# EAGLE schematic alu4 (EAGLE 9.5.1)
ALU

## Sheet 1 of 9: Accum Reg
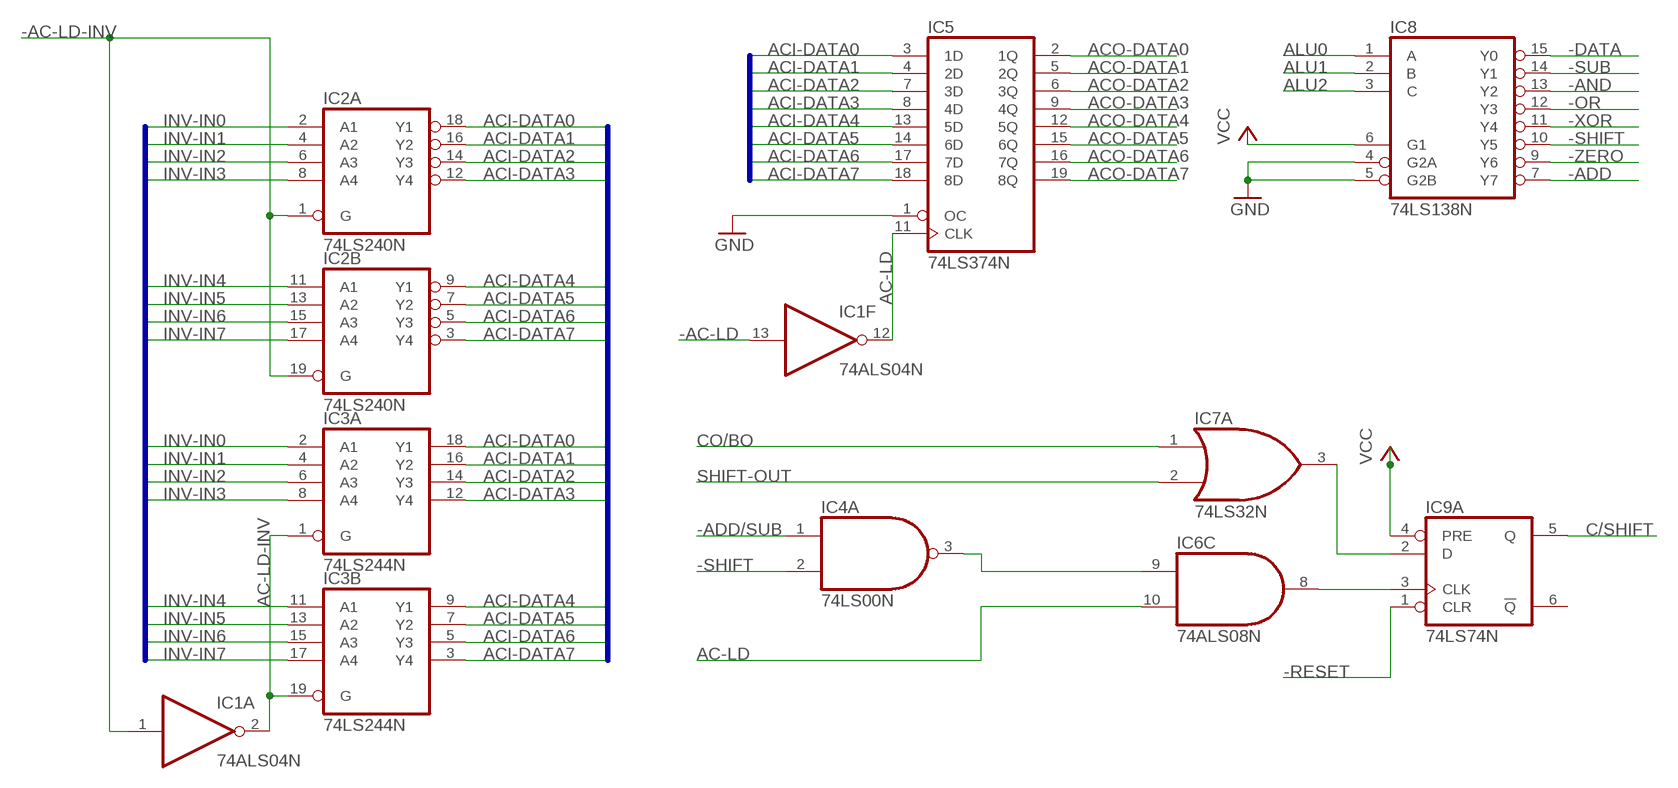
[diagram p0: schematic, sheet 1]

### Parts
IC1  74ALS04N  [DIL14]
IC2  74LS240N  [DIL20]
IC3  74LS244N  [DIL20]
IC4  74LS00N  [DIL14]
IC5  74LS374N  [DIL20]
IC6  74ALS08N  [DIL14]
IC7  74LS32N  [DIL14]
IC8  74LS138N  [DIL16]
IC9  74LS74N  [DIL14]

### Nets
-AC-LD: IC1.13(F:I) ; also sheet 3,9
-AC-LD-INV: IC1.1(A:I) IC2.1(A:G) IC2.19(B:G) ; also sheet 9
-ADD: IC8.7(Y7) ; also sheet 7
-ADD/SUB: IC4.1(A:I0) ; also sheet 7
-AND: IC8.13(Y2) ; also sheet 4
-DATA: IC8.15(Y0) ; also sheet 3
-OR: IC8.12(Y3) ; also sheet 4
-RESET: IC9.1(A:CLR) ; also sheet 6,9
-SHIFT: IC4.2(A:I1) IC8.10(Y5) ; also sheet 6
-SUB: IC8.14(Y1) ; also sheet 7
-XOR: IC8.11(Y4) ; also sheet 4
-ZERO: IC8.9(Y6) ; also sheet 4
AC-LD: IC1.12(F:O) IC5.11(CLK) IC6.10(C:I1)
AC-LD-INV: IC1.2(A:O) IC3.1(A:G) IC3.19(B:G) ; also sheet 5
ACI-DATA0: IC2.18(A:Y1) IC3.18(A:Y1) IC5.3(1D)
ACI-DATA1: IC2.16(A:Y2) IC3.16(A:Y2) IC5.4(2D)
ACI-DATA2: IC2.14(A:Y3) IC3.14(A:Y3) IC5.7(3D)
ACI-DATA3: IC2.12(A:Y4) IC3.12(A:Y4) IC5.8(4D)
ACI-DATA4: IC2.9(B:Y1) IC3.9(B:Y1) IC5.13(5D)
ACI-DATA5: IC2.7(B:Y2) IC3.7(B:Y2) IC5.14(6D)
ACI-DATA6: IC2.5(B:Y3) IC3.5(B:Y3) IC5.17(7D)
ACI-DATA7: IC2.3(B:Y4) IC3.3(B:Y4) IC5.18(8D)
ACO-DATA0: IC5.2(1Q) ; also sheet 3,4,5,6,7,9
ACO-DATA1: IC5.5(2Q) ; also sheet 3,4,5,6,7,9
ACO-DATA2: IC5.6(3Q) ; also sheet 3,4,5,6,7,9
ACO-DATA3: IC5.9(4Q) ; also sheet 3,4,5,6,7,9
ACO-DATA4: IC5.12(5Q) ; also sheet 3,4,5,6,7,9
ACO-DATA5: IC5.15(6Q) ; also sheet 3,4,5,6,7,9
ACO-DATA6: IC5.16(7Q) ; also sheet 3,4,5,6,7,9
ACO-DATA7: IC5.19(8Q) ; also sheet 3,4,5,6,7,9
ALU0: IC8.1(A) ; also sheet 5,6,9
ALU1: IC8.2(B) ; also sheet 5,6,9
ALU2: IC8.3(C) ; also sheet 5,6,9
C/SHIFT: IC9.5(A:Q) ; also sheet 5,6,7,9
CO/BO: IC7.1(A:I0) ; also sheet 7
GND: IC5.1(OC) IC8.4(G2A) IC8.5(G2B) ; also sheet 2,4,5,6,8,9
INV-IN0: IC2.2(A:A1) IC3.2(A:A1) ; also sheet 3,4,6,7
INV-IN1: IC2.4(A:A2) IC3.4(A:A2) ; also sheet 3,4,6,7
INV-IN2: IC2.6(A:A3) IC3.6(A:A3) ; also sheet 3,4,6,7
INV-IN3: IC2.8(A:A4) IC3.8(A:A4) ; also sheet 3,4,6,7
INV-IN4: IC2.11(B:A1) IC3.11(B:A1) ; also sheet 3,4,6,7
INV-IN5: IC2.13(B:A2) IC3.13(B:A2) ; also sheet 3,4,6,7
INV-IN6: IC2.15(B:A3) IC3.15(B:A3) ; also sheet 3,4,6,7
INV-IN7: IC2.17(B:A4) IC3.17(B:A4) ; also sheet 3,4,6,7
N$3: IC4.3(A:O) IC6.9(C:I0)
N$5: IC6.8(C:O) IC9.3(A:CLK)
N$7: IC7.3(A:O) IC9.2(A:D)
SHIFT-OUT: IC7.2(A:I1) ; also sheet 6
VCC: IC8.6(G1) IC9.4(A:PRE) ; also sheet 2,5,6,9
Unconnected: IC9.6(A:!Q)

### Buses
INV-IN[0..7]
ACI-DATA[0..7]

## Sheet 2 of 9: caps & pullups
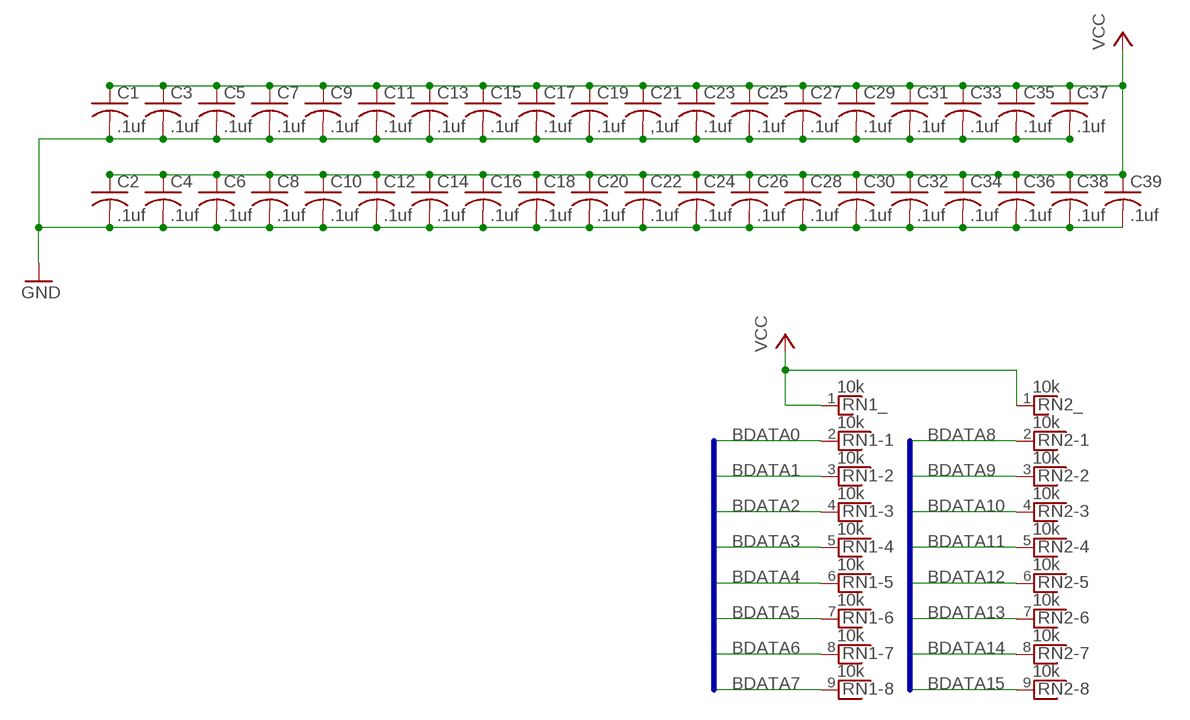
[diagram p1: schematic, sheet 2]

### Parts
C1  .1uf  C-US025-024X044  [C025-024X044]
C2  .1uf  C-US025-024X044  [C025-024X044]
C3  .1uf  C-US025-024X044  [C025-024X044]
C4  .1uf  C-US025-024X044  [C025-024X044]
C5  .1uf  C-US025-024X044  [C025-024X044]
C6  .1uf  C-US025-024X044  [C025-024X044]
C7  .1uf  C-US025-024X044  [C025-024X044]
C8  .1uf  C-US025-024X044  [C025-024X044]
C9  .1uf  C-US025-024X044  [C025-024X044]
C10  .1uf  C-US025-024X044  [C025-024X044]
C11  .1uf  C-US025-024X044  [C025-024X044]
C12  .1uf  C-US025-024X044  [C025-024X044]
C13  .1uf  C-US025-024X044  [C025-024X044]
C14  .1uf  C-US025-024X044  [C025-024X044]
C15  .1uf  C-US025-024X044  [C025-024X044]
C16  .1uf  C-US025-024X044  [C025-024X044]
C17  .1uf  C-US025-024X044  [C025-024X044]
C18  .1uf  C-US025-024X044  [C025-024X044]
C19  .1uf  C-US025-024X044  [C025-024X044]
C20  .1uf  C-US025-024X044  [C025-024X044]
C21  ,1uf  C-US025-024X044  [C025-024X044]
C22  .1uf  C-US025-024X044  [C025-024X044]
C23  .1uf  C-US025-024X044  [C025-024X044]
C24  .1uf  C-US025-024X044  [C025-024X044]
C25  .1uf  C-US025-024X044  [C025-024X044]
C26  .1uf  C-US025-024X044  [C025-024X044]
C27  .1uf  C-US025-024X044  [C025-024X044]
C28  .1uf  C-US025-024X044  [C025-024X044]
C29  .1uf  C-US025-024X044  [C025-024X044]
C30  .1uf  C-US025-024X044  [C025-024X044]
C31  .1uf  C-US025-024X044  [C025-024X044]
C32  .1uf  C-US025-024X044  [C025-024X044]
C33  .1uf  C-US025-024X044  [C025-024X044]
C34  .1uf  C-US025-024X044  [C025-024X044]
C35  .1uf  C-US025-024X044  [C025-024X044]
C36  .1uf  C-US025-024X044  [C025-024X044]
C37  .1uf  C-US025-024X044  [C025-024X044]
C38  .1uf  C-US025-024X044  [C025-024X044]
C39  .1uf  C-US025-024X044  [C025-024X044]
RN1  10k  RNX8  [RN-9]
RN2  10k  RNX8  [RN-9]

### Nets
BDATA0: RN1.2 ; also sheet 3,4,5,7
BDATA1: RN1.3 ; also sheet 3,4,5,7
BDATA2: RN1.4 ; also sheet 3,4,5,7
BDATA3: RN1.5 ; also sheet 3,4,5,7
BDATA4: RN1.6 ; also sheet 3,4,5,7
BDATA5: RN1.7 ; also sheet 3,4,5,7
BDATA6: RN1.8 ; also sheet 3,4,5,7
BDATA7: RN1.9 ; also sheet 3,4,5,7
BDATA8: RN2.2 ; also sheet 3,5
BDATA9: RN2.3 ; also sheet 3,5
BDATA10: RN2.4 ; also sheet 3,5
BDATA11: RN2.5 ; also sheet 3,5
BDATA12: RN2.6 ; also sheet 3,5
BDATA13: RN2.7 ; also sheet 3,5
BDATA14: RN2.8 ; also sheet 3,5
BDATA15: RN2.9 ; also sheet 3,5
GND: C1.2 C2.2 C3.2 C4.2 C5.2 C6.2 C7.2 C8.2 C9.2 C10.2 C11.2 C12.2 C13.2 C14.2 C15.2 C16.2 C17.2 C18.2 C19.2 C20.2 C21.2 C22.2 C23.2 C24.2 C25.2 C26.2 C27.2 C28.2 C29.2 C30.2 C31.2 C32.2 C33.2 C34.2 C35.2 C36.2 C37.2 C38.2 C39.2 ; also sheet 1,4,5,6,8,9
VCC: C1.1 C2.1 C3.1 C4.1 C5.1 C6.1 C7.1 C8.1 C9.1 C10.1 C11.1 C12.1 C13.1 C14.1 C15.1 C16.1 C17.1 C18.1 C19.1 C20.1 C21.1 C22.1 C23.1 C24.1 C25.1 C26.1 C27.1 C28.1 C29.1 C30.1 C31.1 C32.1 C33.1 C34.1 C35.1 C36.1 C37.1 C38.1 C39.1 RN1.1 RN2.1 ; also sheet 1,5,6,9

### Buses
BDATA[0..15]

## Sheet 3 of 9: Bus Buffering
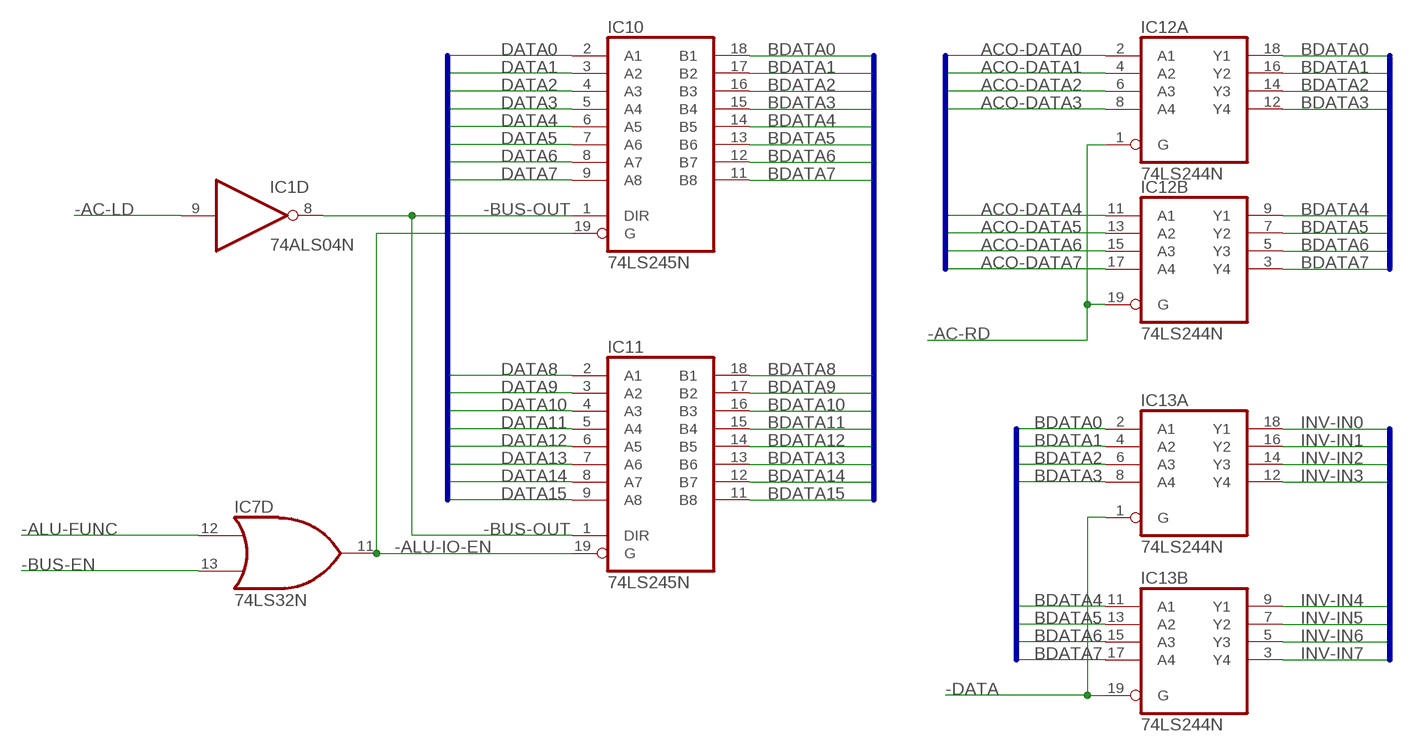
[diagram p2: schematic, sheet 3]

### Parts
IC10  74LS245N  [DIL20]
IC11  74LS245N  [DIL20]
IC12  74LS244N  [DIL20]
IC13  74LS244N  [DIL20]

### Nets
-AC-LD: IC1.9(D:I) ; also sheet 1,9
-AC-RD: IC12.1(A:G) IC12.19(B:G) ; also sheet 9
-ALU-FUNC: IC7.12(D:I0) ; also sheet 9
-ALU-IO-EN: IC7.11(D:O) IC10.19(G) IC11.19(G)
-BUS-EN: IC7.13(D:I1) ; also sheet 9
-BUS-OUT: IC1.8(D:O) IC10.1(DIR) IC11.1(DIR)
-DATA: IC13.1(A:G) IC13.19(B:G) ; also sheet 1
ACO-DATA0: IC12.2(A:A1) ; also sheet 1,4,5,6,7,9
ACO-DATA1: IC12.4(A:A2) ; also sheet 1,4,5,6,7,9
ACO-DATA2: IC12.6(A:A3) ; also sheet 1,4,5,6,7,9
ACO-DATA3: IC12.8(A:A4) ; also sheet 1,4,5,6,7,9
ACO-DATA4: IC12.11(B:A1) ; also sheet 1,4,5,6,7,9
ACO-DATA5: IC12.13(B:A2) ; also sheet 1,4,5,6,7,9
ACO-DATA6: IC12.15(B:A3) ; also sheet 1,4,5,6,7,9
ACO-DATA7: IC12.17(B:A4) ; also sheet 1,4,5,6,7,9
BDATA0: IC10.18(B1) IC12.18(A:Y1) IC13.2(A:A1) ; also sheet 2,4,5,7
BDATA1: IC10.17(B2) IC12.16(A:Y2) IC13.4(A:A2) ; also sheet 2,4,5,7
BDATA2: IC10.16(B3) IC12.14(A:Y3) IC13.6(A:A3) ; also sheet 2,4,5,7
BDATA3: IC10.15(B4) IC12.12(A:Y4) IC13.8(A:A4) ; also sheet 2,4,5,7
BDATA4: IC10.14(B5) IC12.9(B:Y1) IC13.11(B:A1) ; also sheet 2,4,5,7
BDATA5: IC10.13(B6) IC12.7(B:Y2) IC13.13(B:A2) ; also sheet 2,4,5,7
BDATA6: IC10.12(B7) IC12.5(B:Y3) IC13.15(B:A3) ; also sheet 2,4,5,7
BDATA7: IC10.11(B8) IC12.3(B:Y4) IC13.17(B:A4) ; also sheet 2,4,5,7
BDATA8: IC11.18(B1) ; also sheet 2,5
BDATA9: IC11.17(B2) ; also sheet 2,5
BDATA10: IC11.16(B3) ; also sheet 2,5
BDATA11: IC11.15(B4) ; also sheet 2,5
BDATA12: IC11.14(B5) ; also sheet 2,5
BDATA13: IC11.13(B6) ; also sheet 2,5
BDATA14: IC11.12(B7) ; also sheet 2,5
BDATA15: IC11.11(B8) ; also sheet 2,5
DATA0: IC10.2(A1) ; also sheet 9
DATA1: IC10.3(A2) ; also sheet 9
DATA2: IC10.4(A3) ; also sheet 9
DATA3: IC10.5(A4) ; also sheet 9
DATA4: IC10.6(A5) ; also sheet 9
DATA5: IC10.7(A6) ; also sheet 9
DATA6: IC10.8(A7) ; also sheet 9
DATA7: IC10.9(A8) ; also sheet 9
DATA8: IC11.2(A1) ; also sheet 9
DATA9: IC11.3(A2) ; also sheet 9
DATA10: IC11.4(A3) ; also sheet 9
DATA11: IC11.5(A4) ; also sheet 9
DATA12: IC11.6(A5) ; also sheet 9
DATA13: IC11.7(A6) ; also sheet 9
DATA14: IC11.8(A7) ; also sheet 9
DATA15: IC11.9(A8) ; also sheet 9
INV-IN0: IC13.18(A:Y1) ; also sheet 1,4,6,7
INV-IN1: IC13.16(A:Y2) ; also sheet 1,4,6,7
INV-IN2: IC13.14(A:Y3) ; also sheet 1,4,6,7
INV-IN3: IC13.12(A:Y4) ; also sheet 1,4,6,7
INV-IN4: IC13.9(B:Y1) ; also sheet 1,4,6,7
INV-IN5: IC13.7(B:Y2) ; also sheet 1,4,6,7
INV-IN6: IC13.5(B:Y3) ; also sheet 1,4,6,7
INV-IN7: IC13.3(B:Y4) ; also sheet 1,4,6,7

### Buses
BDATA[0..15]
DATA[0..15]
INV-IN[0..7]
BDATA[0..7]
ACO-DATA[0..7]

## Sheet 4 of 9: Logical
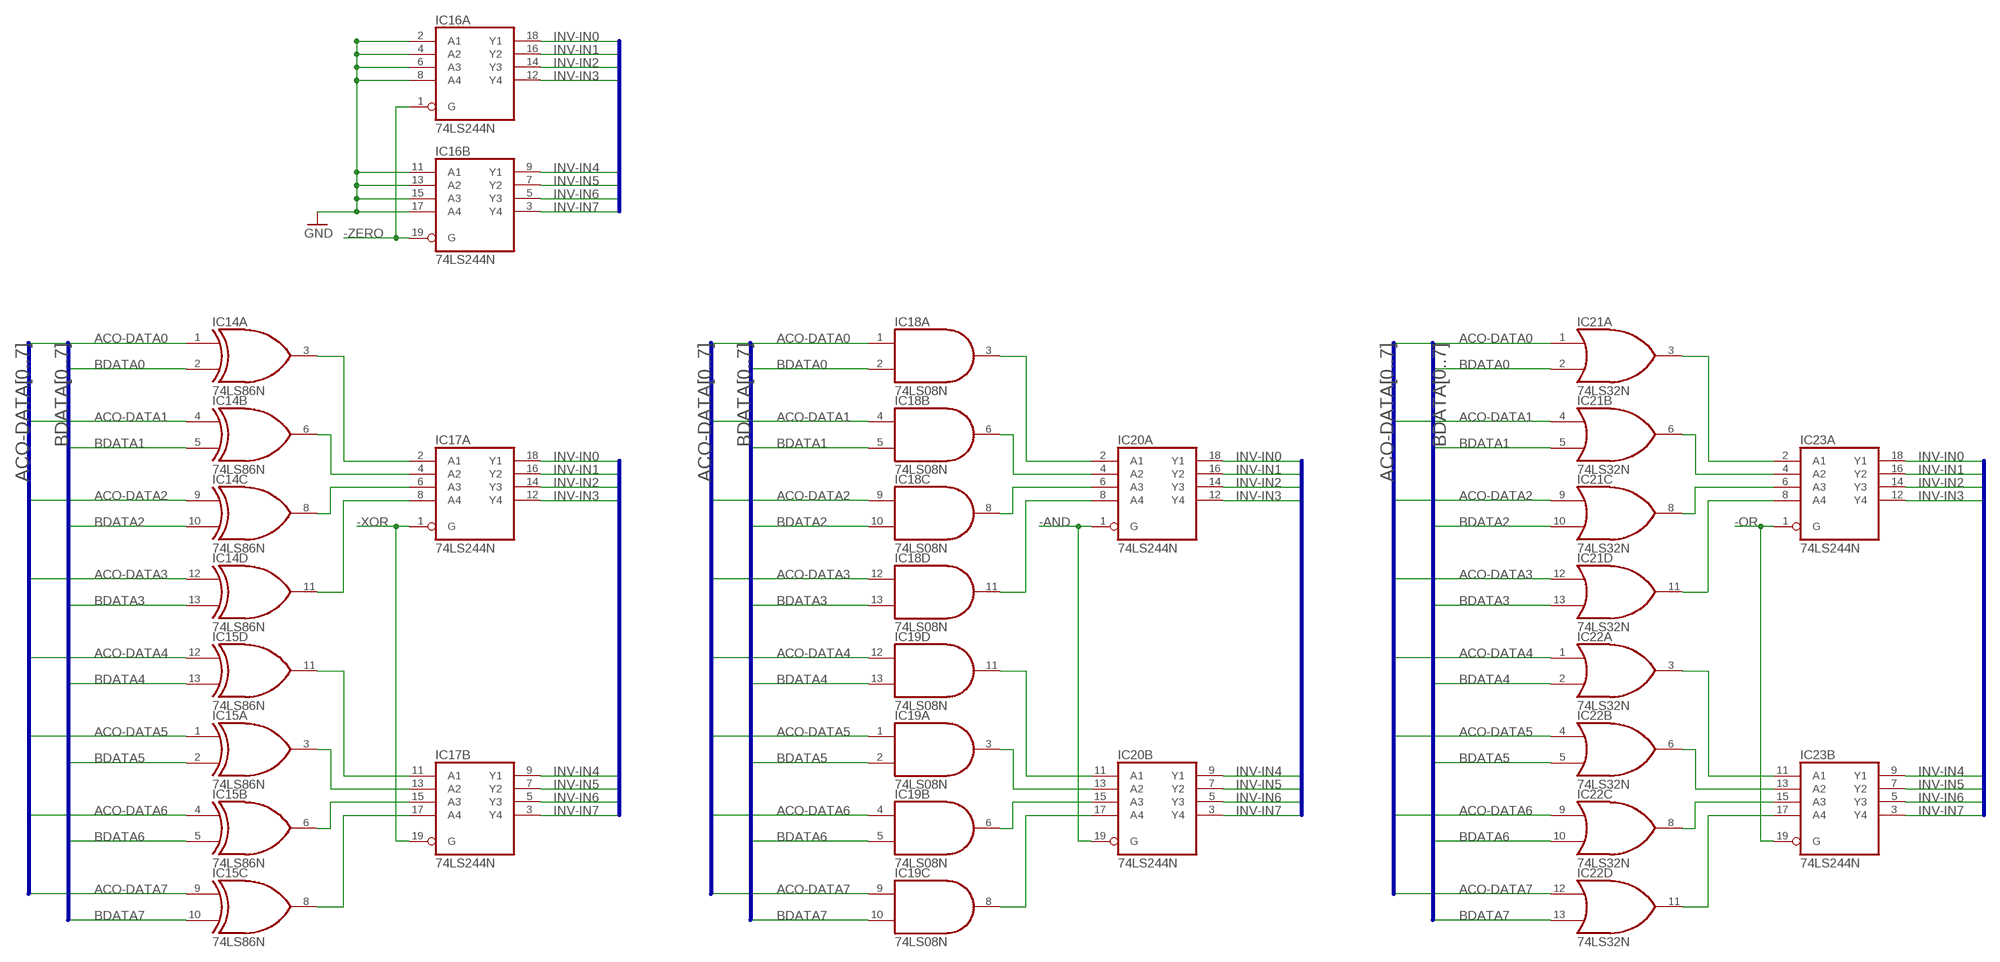
[diagram p3: schematic, sheet 4]

### Parts
IC14  74LS86N  [DIL14]
IC15  74LS86N  [DIL14]
IC16  74LS244N  [DIL20]
IC17  74LS244N  [DIL20]
IC18  74LS08N  [DIL14]
IC19  74LS08N  [DIL14]
IC20  74LS244N  [DIL20]
IC21  74LS32N  [DIL14]
IC22  74LS32N  [DIL14]
IC23  74LS244N  [DIL20]

### Nets
-AND: IC20.1(A:G) IC20.19(B:G) ; also sheet 1
-OR: IC23.1(A:G) IC23.19(B:G) ; also sheet 1
-XOR: IC17.1(A:G) IC17.19(B:G) ; also sheet 1
-ZERO: IC16.1(A:G) IC16.19(B:G) ; also sheet 1
ACO-DATA0: IC14.1(A:I0) IC18.1(A:I0) IC21.1(A:I0) ; also sheet 1,3,5,6,7,9
ACO-DATA1: IC14.4(B:I0) IC18.4(B:I0) IC21.4(B:I0) ; also sheet 1,3,5,6,7,9
ACO-DATA2: IC14.9(C:I0) IC18.9(C:I0) IC21.9(C:I0) ; also sheet 1,3,5,6,7,9
ACO-DATA3: IC14.12(D:I0) IC18.12(D:I0) IC21.12(D:I0) ; also sheet 1,3,5,6,7,9
ACO-DATA4: IC15.12(D:I0) IC19.12(D:I0) IC22.1(A:I0) ; also sheet 1,3,5,6,7,9
ACO-DATA5: IC15.1(A:I0) IC19.1(A:I0) IC22.4(B:I0) ; also sheet 1,3,5,6,7,9
ACO-DATA6: IC15.4(B:I0) IC19.4(B:I0) IC22.9(C:I0) ; also sheet 1,3,5,6,7,9
ACO-DATA7: IC15.9(C:I0) IC19.9(C:I0) IC22.12(D:I0) ; also sheet 1,3,5,6,7,9
BDATA0: IC14.2(A:I1) IC18.2(A:I1) IC21.2(A:I1) ; also sheet 2,3,5,7
BDATA1: IC14.5(B:I1) IC18.5(B:I1) IC21.5(B:I1) ; also sheet 2,3,5,7
BDATA2: IC14.10(C:I1) IC18.10(C:I1) IC21.10(C:I1) ; also sheet 2,3,5,7
BDATA3: IC14.13(D:I1) IC18.13(D:I1) IC21.13(D:I1) ; also sheet 2,3,5,7
BDATA4: IC15.13(D:I1) IC19.13(D:I1) IC22.2(A:I1) ; also sheet 2,3,5,7
BDATA5: IC15.2(A:I1) IC19.2(A:I1) IC22.5(B:I1) ; also sheet 2,3,5,7
BDATA6: IC15.5(B:I1) IC19.5(B:I1) IC22.10(C:I1) ; also sheet 2,3,5,7
BDATA7: IC15.10(C:I1) IC19.10(C:I1) IC22.13(D:I1) ; also sheet 2,3,5,7
GND: IC16.2(A:A1) IC16.4(A:A2) IC16.6(A:A3) IC16.8(A:A4) IC16.11(B:A1) IC16.13(B:A2) IC16.15(B:A3) IC16.17(B:A4) ; also sheet 1,2,5,6,8,9
INV-IN0: IC16.18(A:Y1) IC17.18(A:Y1) IC20.18(A:Y1) IC23.18(A:Y1) ; also sheet 1,3,6,7
INV-IN1: IC16.16(A:Y2) IC17.16(A:Y2) IC20.16(A:Y2) IC23.16(A:Y2) ; also sheet 1,3,6,7
INV-IN2: IC16.14(A:Y3) IC17.14(A:Y3) IC20.14(A:Y3) IC23.14(A:Y3) ; also sheet 1,3,6,7
INV-IN3: IC16.12(A:Y4) IC17.12(A:Y4) IC20.12(A:Y4) IC23.12(A:Y4) ; also sheet 1,3,6,7
INV-IN4: IC16.9(B:Y1) IC17.9(B:Y1) IC20.9(B:Y1) IC23.9(B:Y1) ; also sheet 1,3,6,7
INV-IN5: IC16.7(B:Y2) IC17.7(B:Y2) IC20.7(B:Y2) IC23.7(B:Y2) ; also sheet 1,3,6,7
INV-IN6: IC16.5(B:Y3) IC17.5(B:Y3) IC20.5(B:Y3) IC23.5(B:Y3) ; also sheet 1,3,6,7
INV-IN7: IC16.3(B:Y4) IC17.3(B:Y4) IC20.3(B:Y4) IC23.3(B:Y4) ; also sheet 1,3,6,7
N$77: IC21.3(A:O) IC23.2(A:A1)
N$78: IC21.6(B:O) IC23.4(A:A2)
N$79: IC21.8(C:O) IC23.6(A:A3)
N$81: IC21.11(D:O) IC23.8(A:A4)
N$82: IC22.3(A:O) IC23.11(B:A1)
N$83: IC22.6(B:O) IC23.13(B:A2)
N$84: IC22.8(C:O) IC23.15(B:A3)
N$85: IC22.11(D:O) IC23.17(B:A4)
N$86: IC18.3(A:O) IC20.2(A:A1)
N$87: IC18.6(B:O) IC20.4(A:A2)
N$88: IC18.8(C:O) IC20.6(A:A3)
N$89: IC18.11(D:O) IC20.8(A:A4)
N$90: IC19.11(D:O) IC20.11(B:A1)
N$91: IC19.3(A:O) IC20.13(B:A2)
N$92: IC19.6(B:O) IC20.15(B:A3)
N$93: IC19.8(C:O) IC20.17(B:A4)
N$94: IC14.3(A:O) IC17.2(A:A1)
N$95: IC14.6(B:O) IC17.4(A:A2)
N$96: IC14.8(C:O) IC17.6(A:A3)
N$97: IC14.11(D:O) IC17.8(A:A4)
N$98: IC15.11(D:O) IC17.11(B:A1)
N$99: IC15.3(A:O) IC17.13(B:A2)
N$100: IC15.6(B:O) IC17.15(B:A3)
N$101: IC15.8(C:O) IC17.17(B:A4)

### Buses
INV-IN[0..7]
ACO-DATA[0..7]
BDATA[0..7]

## Sheet 5 of 9: Compare
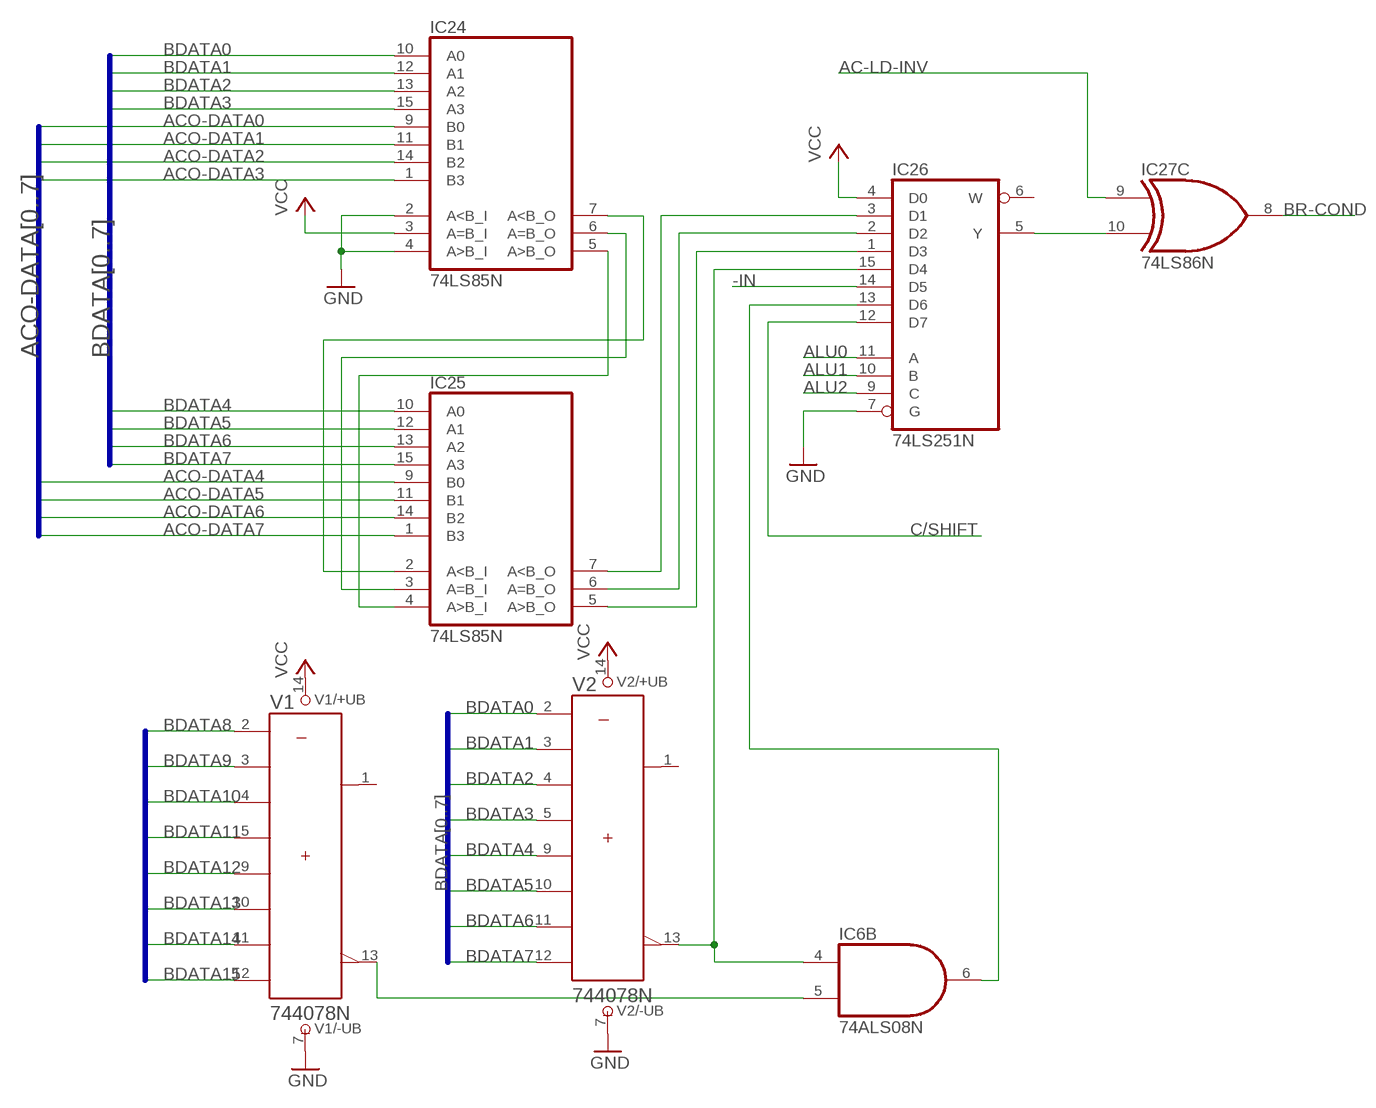
[diagram p4: schematic, sheet 5]

### Parts
IC24  74LS85N  [DIL16]
IC25  74LS85N  [DIL16]
IC26  74LS251N  [DIL16]
IC27  74LS86N  [DIL14]
V1  744078N  [DIL14]
V2  744078N  [DIL14]

### Nets
-IN: IC26.14(D5) ; also sheet 9
AC-LD-INV: IC27.9(C:I0) ; also sheet 1
ACO-DATA0: IC24.9(B0) ; also sheet 1,3,4,6,7,9
ACO-DATA1: IC24.11(B1) ; also sheet 1,3,4,6,7,9
ACO-DATA2: IC24.14(B2) ; also sheet 1,3,4,6,7,9
ACO-DATA3: IC24.1(B3) ; also sheet 1,3,4,6,7,9
ACO-DATA4: IC25.9(B0) ; also sheet 1,3,4,6,7,9
ACO-DATA5: IC25.11(B1) ; also sheet 1,3,4,6,7,9
ACO-DATA6: IC25.14(B2) ; also sheet 1,3,4,6,7,9
ACO-DATA7: IC25.1(B3) ; also sheet 1,3,4,6,7,9
ALU0: IC26.11(A) ; also sheet 1,6,9
ALU1: IC26.10(B) ; also sheet 1,6,9
ALU2: IC26.9(C) ; also sheet 1,6,9
BDATA0: IC24.10(A0) V2.2(A) ; also sheet 2,3,4,7
BDATA1: IC24.12(A1) V2.3(B) ; also sheet 2,3,4,7
BDATA2: IC24.13(A2) V2.4(C) ; also sheet 2,3,4,7
BDATA3: IC24.15(A3) V2.5(D) ; also sheet 2,3,4,7
BDATA4: IC25.10(A0) V2.9(E) ; also sheet 2,3,4,7
BDATA5: IC25.12(A1) V2.10(F) ; also sheet 2,3,4,7
BDATA6: IC25.13(A2) V2.11(G) ; also sheet 2,3,4,7
BDATA7: IC25.15(A3) V2.12(H) ; also sheet 2,3,4,7
BDATA8: V1.2(A) ; also sheet 2,3
BDATA9: V1.3(B) ; also sheet 2,3
BDATA10: V1.4(C) ; also sheet 2,3
BDATA11: V1.5(D) ; also sheet 2,3
BDATA12: V1.9(E) ; also sheet 2,3
BDATA13: V1.10(F) ; also sheet 2,3
BDATA14: V1.11(G) ; also sheet 2,3
BDATA15: V1.12(H) ; also sheet 2,3
BR-COND: IC27.8(C:O) ; also sheet 9
C/SHIFT: IC26.12(D7) ; also sheet 1,6,7,9
GND: IC24.2(A<B_I) IC24.4(A>B_I) IC26.7(G) V1.7(-UB) V2.7(-UB) ; also sheet 1,2,4,6,8,9
N$6: IC6.4(B:I0) IC26.15(D4) V2.13(W)
N$43: IC24.5(A>B_O) IC25.4(A>B_I)
N$45: IC24.6(A=B_O) IC25.3(A=B_I)
N$46: IC24.7(A<B_O) IC25.2(A<B_I)
N$47: IC25.7(A<B_O) IC26.3(D1)
N$48: IC25.6(A=B_O) IC26.2(D2)
N$49: IC25.5(A>B_O) IC26.1(D3)
N$52: IC6.5(B:I1) V1.13(W)
N$55: IC6.6(B:O) IC26.13(D6)
N$56: IC26.5(Y) IC27.10(C:I1)
VCC: IC24.3(A=B_I) IC26.4(D0) V1.14(+UB) V2.14(+UB) ; also sheet 1,2,6,9
Unconnected: IC26.6(W) V1.1(Y) V2.1(Y)

### Buses
ACO-DATA[0..7]
BDATA[0..7]
BDATA[8..15]

## Sheet 6 of 9: Shifter
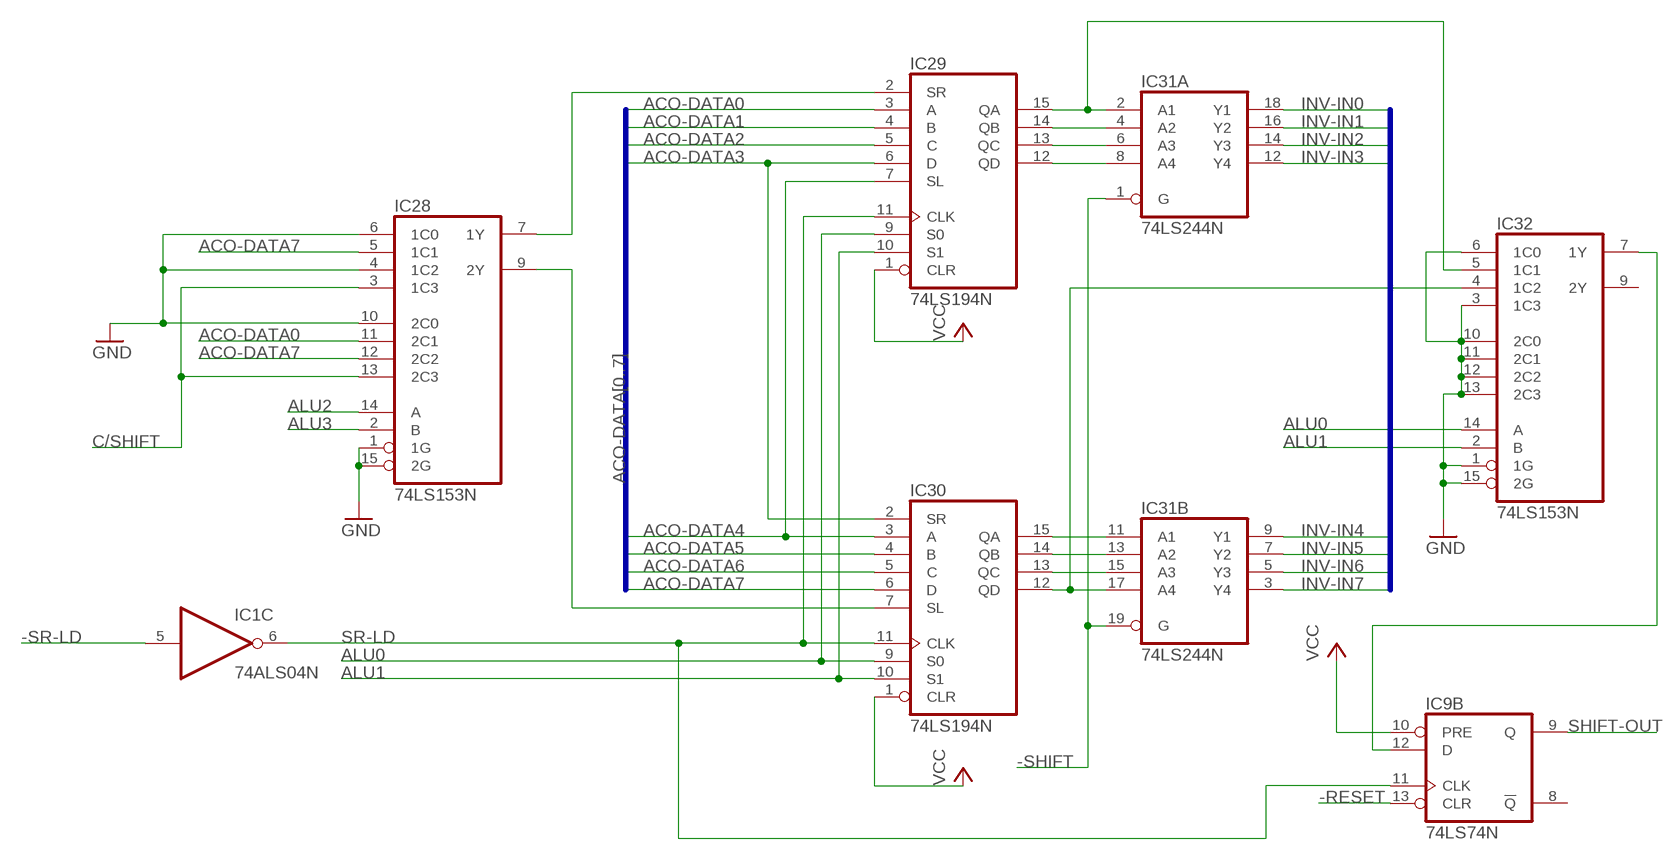
[diagram p5: schematic, sheet 6]

### Parts
IC28  74LS153N  [DIL16]
IC29  74LS194N  [DIL16]
IC30  74LS194N  [DIL16]
IC31  74LS244N  [DIL20]
IC32  74LS153N  [DIL16]

### Nets
-RESET: IC9.13(B:CLR) ; also sheet 1,9
-SHIFT: IC31.1(A:G) IC31.19(B:G) ; also sheet 1
-SR-LD: IC1.5(C:I) ; also sheet 9
ACO-DATA0: IC28.11(2C1) IC29.3(A) ; also sheet 1,3,4,5,7,9
ACO-DATA1: IC29.4(B) ; also sheet 1,3,4,5,7,9
ACO-DATA2: IC29.5(C) ; also sheet 1,3,4,5,7,9
ACO-DATA3: IC29.6(D) IC30.2(SR) ; also sheet 1,3,4,5,7,9
ACO-DATA4: IC29.7(SL) IC30.3(A) ; also sheet 1,3,4,5,7,9
ACO-DATA5: IC30.4(B) ; also sheet 1,3,4,5,7,9
ACO-DATA6: IC30.5(C) ; also sheet 1,3,4,5,7,9
ACO-DATA7: IC28.5(1C1) IC28.12(2C2) IC30.6(D) ; also sheet 1,3,4,5,7,9
ALU0: IC29.9(S0) IC30.9(S0) IC32.14(A) ; also sheet 1,5,9
ALU1: IC29.10(S1) IC30.10(S1) IC32.2(B) ; also sheet 1,5,9
ALU2: IC28.14(A) ; also sheet 1,5,9
ALU3: IC28.2(B) ; also sheet 7,9
C/SHIFT: IC28.3(1C3) IC28.13(2C3) ; also sheet 1,5,7,9
GND: IC28.1(1G) IC28.4(1C2) IC28.6(1C0) IC28.10(2C0) IC28.15(2G) IC32.1(1G) IC32.3(1C3) IC32.6(1C0) IC32.10(2C0) IC32.11(2C1) IC32.12(2C2) IC32.13(2C3) IC32.15(2G) ; also sheet 1,2,4,5,8,9
INV-IN0: IC31.18(A:Y1) ; also sheet 1,3,4,7
INV-IN1: IC31.16(A:Y2) ; also sheet 1,3,4,7
INV-IN2: IC31.14(A:Y3) ; also sheet 1,3,4,7
INV-IN3: IC31.12(A:Y4) ; also sheet 1,3,4,7
INV-IN4: IC31.9(B:Y1) ; also sheet 1,3,4,7
INV-IN5: IC31.7(B:Y2) ; also sheet 1,3,4,7
INV-IN6: IC31.5(B:Y3) ; also sheet 1,3,4,7
INV-IN7: IC31.3(B:Y4) ; also sheet 1,3,4,7
N$11: IC9.12(B:D) IC32.7(1Y)
N$57: IC29.15(QA) IC31.2(A:A1) IC32.5(1C1)
N$66: IC29.14(QB) IC31.4(A:A2)
N$69: IC29.13(QC) IC31.6(A:A3)
N$70: IC29.12(QD) IC31.8(A:A4)
N$71: IC30.15(QA) IC31.11(B:A1)
N$72: IC30.14(QB) IC31.13(B:A2)
N$73: IC30.13(QC) IC31.15(B:A3)
N$74: IC30.12(QD) IC31.17(B:A4) IC32.4(1C2)
N$75: IC28.7(1Y) IC29.2(SR)
N$76: IC28.9(2Y) IC30.7(SL)
SHIFT-OUT: IC9.9(B:Q) ; also sheet 1
SR-LD: IC1.6(C:O) IC9.11(B:CLK) IC29.11(CLK) IC30.11(CLK)
VCC: IC9.10(B:PRE) IC29.1(CLR) IC30.1(CLR) ; also sheet 1,2,5,9
Unconnected: IC9.8(B:!Q) IC32.9(2Y)

### Buses
INV-IN[0..7]
ACO-DATA[0..7]

## Sheet 7 of 9: Add/Sub
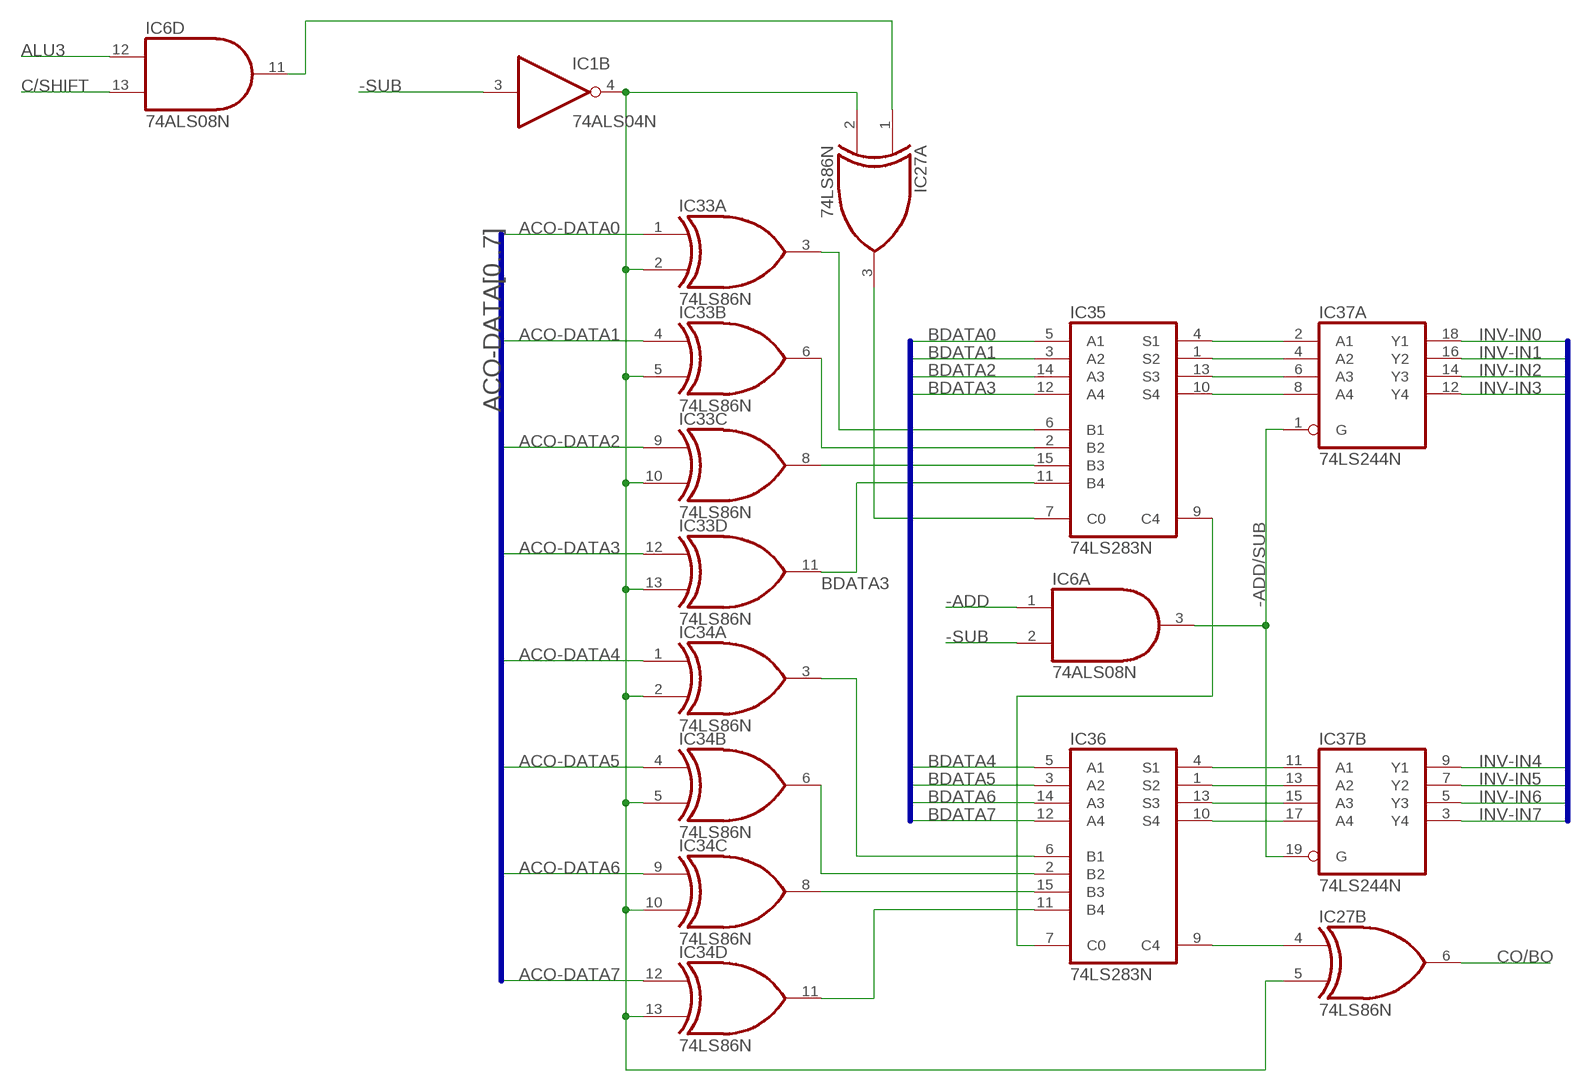
[diagram p6: schematic, sheet 7]

### Parts
IC33  74LS86N  [DIL14]
IC34  74LS86N  [DIL14]
IC35  74LS283N  [DIL16]
IC36  74LS283N  [DIL16]
IC37  74LS244N  [DIL20]

### Nets
-ADD: IC6.1(A:I0) ; also sheet 1
-ADD/SUB: IC6.3(A:O) IC37.1(A:G) IC37.19(B:G) ; also sheet 1
-SUB: IC1.3(B:I) IC6.2(A:I1) ; also sheet 1
ACO-DATA0: IC33.1(A:I0) ; also sheet 1,3,4,5,6,9
ACO-DATA1: IC33.4(B:I0) ; also sheet 1,3,4,5,6,9
ACO-DATA2: IC33.9(C:I0) ; also sheet 1,3,4,5,6,9
ACO-DATA3: IC33.12(D:I0) ; also sheet 1,3,4,5,6,9
ACO-DATA4: IC34.1(A:I0) ; also sheet 1,3,4,5,6,9
ACO-DATA5: IC34.4(B:I0) ; also sheet 1,3,4,5,6,9
ACO-DATA6: IC34.9(C:I0) ; also sheet 1,3,4,5,6,9
ACO-DATA7: IC34.12(D:I0) ; also sheet 1,3,4,5,6,9
ALU3: IC6.12(D:I0) ; also sheet 6,9
BDATA0: IC35.5(A1) ; also sheet 2,3,4,5
BDATA1: IC35.3(A2) ; also sheet 2,3,4,5
BDATA2: IC35.14(A3) ; also sheet 2,3,4,5
BDATA3: IC35.12(A4) ; also sheet 2,3,4,5
BDATA4: IC36.5(A1) ; also sheet 2,3,4,5
BDATA5: IC36.3(A2) ; also sheet 2,3,4,5
BDATA6: IC36.14(A3) ; also sheet 2,3,4,5
BDATA7: IC36.12(A4) ; also sheet 2,3,4,5
C/SHIFT: IC6.13(D:I1) ; also sheet 1,5,6,9
CO/BO: IC27.6(B:O) ; also sheet 1
INV-IN0: IC37.18(A:Y1) ; also sheet 1,3,4,6
INV-IN1: IC37.16(A:Y2) ; also sheet 1,3,4,6
INV-IN2: IC37.14(A:Y3) ; also sheet 1,3,4,6
INV-IN3: IC37.12(A:Y4) ; also sheet 1,3,4,6
INV-IN4: IC37.9(B:Y1) ; also sheet 1,3,4,6
INV-IN5: IC37.7(B:Y2) ; also sheet 1,3,4,6
INV-IN6: IC37.5(B:Y3) ; also sheet 1,3,4,6
INV-IN7: IC37.3(B:Y4) ; also sheet 1,3,4,6
N$1: IC27.4(B:I0) IC36.9(C4)
N$2: IC27.3(A:O) IC35.7(C0)
N$8: IC6.11(D:O) IC27.1(A:I0)
N$12: IC33.6(B:O) IC35.2(B2)
N$13: IC34.6(B:O) IC36.2(B2)
N$26: IC33.8(C:O) IC35.15(B3)
N$27: IC33.11(D:O) IC35.11(B4)
N$28: IC33.3(A:O) IC35.6(B1)
N$29: IC34.3(A:O) IC36.6(B1)
N$31: IC34.8(C:O) IC36.15(B3)
N$32: IC34.11(D:O) IC36.11(B4)
N$33: IC35.4(S1) IC37.2(A:A1)
N$34: IC35.1(S2) IC37.4(A:A2)
N$35: IC35.13(S3) IC37.6(A:A3)
N$36: IC35.10(S4) IC37.8(A:A4)
N$37: IC36.4(S1) IC37.11(B:A1)
N$38: IC36.1(S2) IC37.13(B:A2)
N$39: IC36.13(S3) IC37.15(B:A3)
N$40: IC36.10(S4) IC37.17(B:A4)
N$41: IC35.9(C4) IC36.7(C0)
SUB: IC1.4(B:O) IC27.2(A:I1) IC27.5(B:I1) IC33.2(A:I1) IC33.5(B:I1) IC33.10(C:I1) IC33.13(D:I1) IC34.2(A:I1) IC34.5(B:I1) IC34.10(C:I1) IC34.13(D:I1)

### Buses
INV-IN[0..7]
ACO-DATA[0..7]
BDATA[0..7]

## Sheet 8 of 9: unused
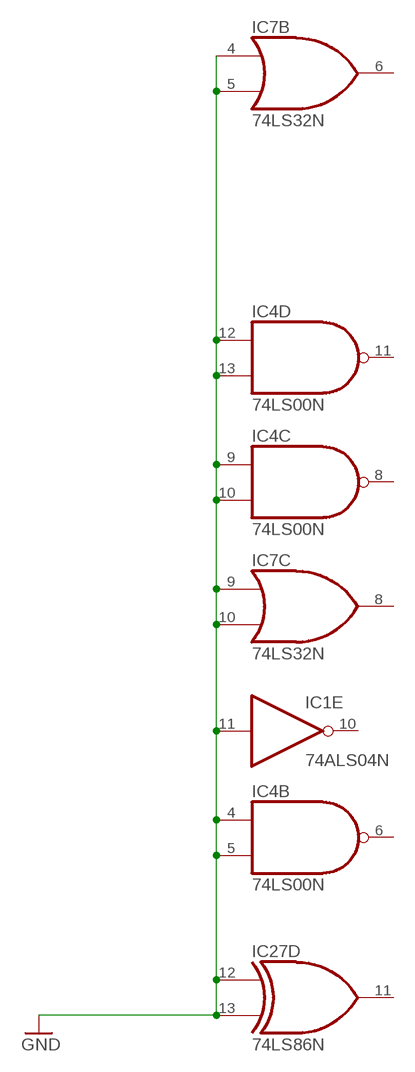
[diagram p7: schematic, sheet 8]

### Nets
GND: IC1.11(E:I) IC4.4(B:I0) IC4.5(B:I1) IC4.9(C:I0) IC4.10(C:I1) IC4.12(D:I0) IC4.13(D:I1) IC7.4(B:I0) IC7.5(B:I1) IC7.9(C:I0) IC7.10(C:I1) IC27.12(D:I0) IC27.13(D:I1) ; also sheet 1,2,4,5,6,9
Unconnected: IC1.10(E:O) IC4.6(B:O) IC4.8(C:O) IC4.11(D:O) IC7.6(B:O) IC7.8(C:O) IC27.11(D:O)

## Sheet 9 of 9: BUS
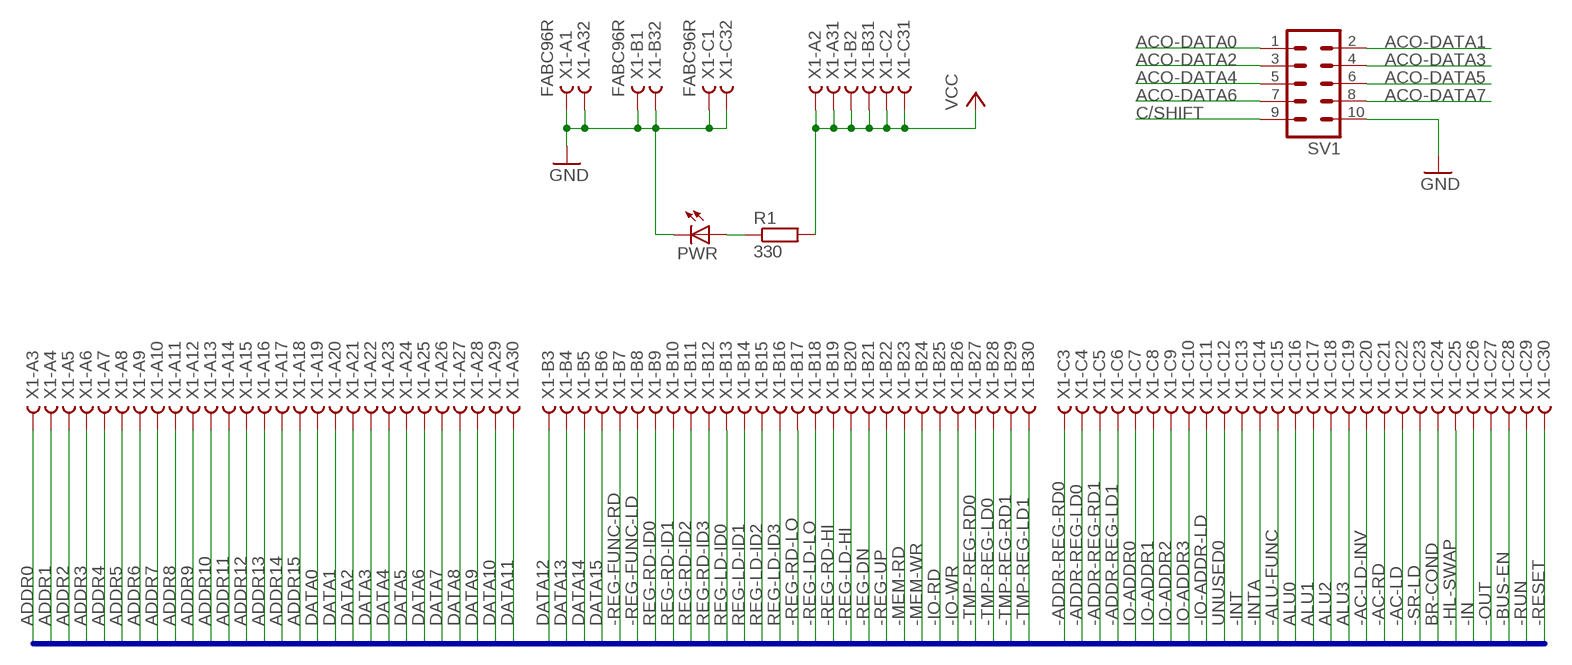
[diagram p8: schematic, sheet 9]

### Parts
PWR  LED5MM  [LED5MM]
R1  330  R0207/10  [0207/10]
SV1  MA05-2  [MA05-2]
X1  FABC96R  [FABC96R]

### Nets
-AC-LD: X1.C22 ; also sheet 1,3
-AC-LD-INV: X1.C20 ; also sheet 1
-AC-RD: X1.C21 ; also sheet 3
-ADDR-REG-LD0: X1.C4
-ADDR-REG-LD1: X1.C6
-ADDR-REG-RD0: X1.C3
-ADDR-REG-RD1: X1.C5
-ALU-FUNC: X1.C15 ; also sheet 3
-BUS-EN: X1.C28 ; also sheet 3
-HL-SWAP: X1.C25
-IN: X1.C26 ; also sheet 5
-INT: X1.C13
-INTA: X1.C14
-IO-ADDR-LD: X1.C11
-IO-RD: X1.B25
-IO-WR: X1.B26
-MEM-RD: X1.B23
-MEM-WR: X1.B24
-OUT: X1.C27
-REG-DN: X1.B21
-REG-FUNC-LD: X1.B8
-REG-FUNC-RD: X1.B7
-REG-LD-HI: X1.B20
-REG-LD-LO: X1.B18
-REG-RD-HI: X1.B19
-REG-RD-LO: X1.B17
-REG-UP: X1.B22
-RESET: X1.C30 ; also sheet 1,6
-RUN: X1.C29
-SR-LD: X1.C23 ; also sheet 6
-TMP-REG-LD0: X1.B28
-TMP-REG-LD1: X1.B30
-TMP-REG-RD0: X1.B27
-TMP-REG-RD1: X1.B29
ACO-DATA0: SV1.1 ; also sheet 1,3,4,5,6,7
ACO-DATA1: SV1.2 ; also sheet 1,3,4,5,6,7
ACO-DATA2: SV1.3 ; also sheet 1,3,4,5,6,7
ACO-DATA3: SV1.4 ; also sheet 1,3,4,5,6,7
ACO-DATA4: SV1.5 ; also sheet 1,3,4,5,6,7
ACO-DATA5: SV1.6 ; also sheet 1,3,4,5,6,7
ACO-DATA6: SV1.7 ; also sheet 1,3,4,5,6,7
ACO-DATA7: SV1.8 ; also sheet 1,3,4,5,6,7
ADDR0: X1.A3
ADDR1: X1.A4
ADDR2: X1.A5
ADDR3: X1.A6
ADDR4: X1.A7
ADDR5: X1.A8
ADDR6: X1.A9
ADDR7: X1.A10
ADDR8: X1.A11
ADDR9: X1.A12
ADDR10: X1.A13
ADDR11: X1.A14
ADDR12: X1.A15
ADDR13: X1.A16
ADDR14: X1.A17
ADDR15: X1.A18
ALU0: X1.C16 ; also sheet 1,5,6
ALU1: X1.C17 ; also sheet 1,5,6
ALU2: X1.C18 ; also sheet 1,5,6
ALU3: X1.C19 ; also sheet 6,7
BR-COND: X1.C24 ; also sheet 5
C/SHIFT: SV1.9 ; also sheet 1,5,6,7
DATA0: X1.A19 ; also sheet 3
DATA1: X1.A20 ; also sheet 3
DATA2: X1.A21 ; also sheet 3
DATA3: X1.A22 ; also sheet 3
DATA4: X1.A23 ; also sheet 3
DATA5: X1.A24 ; also sheet 3
DATA6: X1.A25 ; also sheet 3
DATA7: X1.A26 ; also sheet 3
DATA8: X1.A27 ; also sheet 3
DATA9: X1.A28 ; also sheet 3
DATA10: X1.A29 ; also sheet 3
DATA11: X1.A30 ; also sheet 3
DATA12: X1.B3 ; also sheet 3
DATA13: X1.B4 ; also sheet 3
DATA14: X1.B5 ; also sheet 3
DATA15: X1.B6 ; also sheet 3
GND: PWR.K(C) SV1.10 X1.A1 X1.A32 X1.B1 X1.B32 X1.C1 X1.C32 ; also sheet 1,2,4,5,6,8
IO-ADDR0: X1.C7
IO-ADDR1: X1.C8
IO-ADDR2: X1.C9
IO-ADDR3: X1.C10
N$14: PWR.A R1.1
REG-LD-ID0: X1.B13
REG-LD-ID1: X1.B14
REG-LD-ID2: X1.B15
REG-LD-ID3: X1.B16
REG-RD-ID0: X1.B9
REG-RD-ID1: X1.B10
REG-RD-ID2: X1.B11
REG-RD-ID3: X1.B12
UNUSED0: X1.C12
VCC: R1.2 X1.A2 X1.A31 X1.B2 X1.B31 X1.C2 X1.C31 ; also sheet 1,2,5,6

### Buses
ADDR[0..15],DATA[0..15],-REG-FUNC-RD,-REG-FUNC-LD,REG-RD-ID[0..3],REG-LD-ID[0..3],-REG-RD-LO,-REG-LD-LO,-REG-RD-HI,-REG-LD-HI,-REG-DN,-REG-UP,-MEM-RD,-MEM-WR,-IO-RD,-IO-WR,-TMP-REG-RD[0..1],-TMP-REG-LD[0..1],-ADDR-REG-RD[0..1],-ADDR-REG-LD[0..1],IO-ADDR[0..3],-IO-ADDR-LD,UNUSED0,-INT,-INTA,-ALU-FUNC,ALU[0..3],-AC-LD-INV,-AC-LD,-AC-RD,-SR-LD,BR-COND,-HL-SWAP,-IN,-OUT,-BUS-EN,-RESET,-RUN

## Power pins joined to a net without a drawn wire
GND: IC1.7(P:GND) IC2.10(P:GND) IC3.10(P:GND) IC4.7(P:GND) IC5.10(GND) IC6.7(P:GND) IC7.7(P:GND) IC8.8(GND) IC9.7(P:GND) IC10.10(GND) IC11.10(GND) IC12.10(P:GND) IC13.10(P:GND) IC14.7(P:GND) IC15.7(P:GND) IC16.10(P:GND) IC17.10(P:GND) IC18.7(P:GND) IC19.7(P:GND) IC20.10(P:GND) IC21.7(P:GND) IC22.7(P:GND) IC23.10(P:GND) IC24.8(GND) IC25.8(GND) IC26.8(GND) IC27.7(P:GND) IC28.8(GND) IC29.8(GND) IC30.8(GND) IC31.10(P:GND) IC32.8(GND) IC33.7(P:GND) IC34.7(P:GND) IC35.8(GND) IC36.8(GND) IC37.10(P:GND)
VCC: IC1.14(P:VCC) IC2.20(P:VCC) IC3.20(P:VCC) IC4.14(P:VCC) IC5.20(VCC) IC6.14(P:VCC) IC7.14(P:VCC) IC8.16(VCC) IC9.14(P:VCC) IC10.20(VCC) IC11.20(VCC) IC12.20(P:VCC) IC13.20(P:VCC) IC14.14(P:VCC) IC15.14(P:VCC) IC16.20(P:VCC) IC17.20(P:VCC) IC18.14(P:VCC) IC19.14(P:VCC) IC20.20(P:VCC) IC21.14(P:VCC) IC22.14(P:VCC) IC23.20(P:VCC) IC24.16(VCC) IC25.16(VCC) IC26.16(VCC) IC27.14(P:VCC) IC28.16(VCC) IC29.16(VCC) IC30.16(VCC) IC31.20(P:VCC) IC32.16(VCC) IC33.14(P:VCC) IC34.14(P:VCC) IC35.16(VCC) IC36.16(VCC) IC37.20(P:VCC)

## Library data of the parts
C1-C39 = rcl:C-US: CAPACITOR, American symbol
IC1 = 74xx-us:74*04: Hex INVERTER
IC2 = 74xx-us:74*240: Octal BUFFER and LINE DRIVER, 3-state
IC3 IC12 IC13 IC16 IC17 IC20 IC23 IC31 IC37 = 74xx-us:74*244: Octal BUFFER and LINE DRIVER, 3-state
IC4 = 74xx-us:74*00: Quad 2-input NAND gate
IC5 = 74xx-us:74*374: Octal D type transparent LATCH, edge triggered
IC6 IC18 IC19 = 74xx-us:74*08: Quad 2-input AND gate
IC7 IC21 IC22 = 74xx-us:74*32: Quad 2-input OR gate
IC8 = 74xx-us:74*138: 3-line to 8-line DECODER/DEMULTIPLEXER
IC9 = 74xx-us:74*74: Dual D type positive edge triggered FLIP FLOP, preset and clear
IC10 IC11 = 74xx-us:74*245: Octal BUS TRANSCEIVER, 3-state
IC14 IC15 IC27 IC33 IC34 = 74xx-us:74*86: Quad 2-input EXCLUSIV-OR (XOR) gate
IC24 IC25 = 74xx-us:74*85: 4-bit magnitude COMPARATOR
IC26 = 74xx-us:74*251: 1 of 8 data SELECTOR/MULTIPLEXER, 3-state
IC28 IC32 = 74xx-us:74*153: Dual 4-line to 1-line data SELECTOR/MULTIPLEXER
IC29 IC30 = 74xx-us:74*194: 4-bit bidirectional SHIFT REGISTER
IC35 IC36 = 74xx-us:74*283: 4-bit binary FULL ADDER, fast carry
PWR = led:LED: LED OSRAM: - CHIPLED LG R971, LG N971, LY N971, LG Q971, LY Q971, LO R971, LY R971 LH N974, LH R974 LS Q976, LO Q976, LY Q976 LO Q996 - Hyper CHIPLED LW Q18S LB Q993, LB Q99A, LB R99A - SideLED LS A670, LO A670, LY A670, LG A670, LP A670 LB A673, LV A673, LT A673, LW A673 LH A674 LY A675 LS A676, LA A676, LO A676, LY A676, LW A676 LS A679, LY A679, LG A679 - Hyper Micro SIDELED® LS Y876, LA Y876, LO Y876, LY Y876 LT Y87S - SmartLED LW L88C, LW L88S LB L89C, LB L89S, LG L890 LS L89K, LO L89K, LY L89K LS L896, LA L896, LO L896, LY L896 - TOPLED LS T670, LO T670, LY T670, LG T670, LP T670 LSG T670, LSP T670, LSY T670, LOP T670, LYG T670 LG T671, LOG T671, LSG T671 LB T673, LV T673, LT T673, LW T673 LH T674 LS T676, LA T676, LO T676, LY T676, LB T676, LH T676, LSB T676, LW T676 LB T67C, LV T67C, LT T67C, LS T67K, LO T67K, LY T67K, LW E67C LS E67B, LA E67B, LO E67B, LY E67B, LB E67C, LV E67C, LT E67C LW T67C LS T679, LY T679, LG T679 LS T770, LO T770, LY T770, LG T770, LP T770 LB T773, LV T773, LT T773, LW T773 LH T774 LS E675, LA E675, LY E675, LS T675 LS T776, LA T776, LO T776, LY T776, LB T776 LHGB T686 LT T68C, LB T68C - Hyper Mini TOPLED® LB M676 - Mini TOPLED Santana® LG M470 LS M47K, LO M47K, LY M47K Source: http://www.osram.convergy.de LUXEON: - LUMILED® LXK2-PW12-R00, LXK2-PW12-S00, LXK2-PW14-U00, LXK2-PW14-V00 LXK2-PM12-R00, LXK2-PM12-S00, LXK2-PM14-U00 LXK2-PE12-Q00, LXK2-PE12-R00, LXK2-PE12-S00, LXK2-PE14-T00, LXK2-PE14-U00 LXK2-PB12-K00, LXK2-PB12-L00, LXK2-PB12-M00, LXK2-PB14-N00, LXK2-PB14-P00, LXK2-PB14-Q00 LXK2-PR12-L00, LXK2-PR12-M00, LXK2-PR14-Q00, LXK2-PR14-R00 LXK2-PD12-Q00, LXK2-PD12-R00, LXK2-PD12-S00 LXK2-PH12-R00, LXK2-PH12-S00 LXK2-PL12-P00, LXK2-PL12-Q00, LXK2-PL12-R00 Source: www.luxeon.com KINGBRIGHT: KA-3528ASYC Source: www.kingbright.com
R1 = eagle-ltspice:R: RESISTOR, European symbol; SPICEMODEL: NONE; SPICEPREFIX: R
RN1 RN2 = resistor-net:RNX8: RESISTOR NETWORK; OC_FARNELL: unknown; OC_NEWARK: unknown
SV1 = con-lstb:MA05-2: PIN HEADER; OC_FARNELL: unknown; OC_NEWARK: unknown
V1 V2 = 74ttl-din:74*4078: 8-input OR/NOR, complementary outputs
X1 = con-vg:FABC96R: CONNECTOR female, 96 pins, type R, rows ABC, grid 2.54 mm